# EAGLE design gateway_nano (EAGLE 9.3.0)
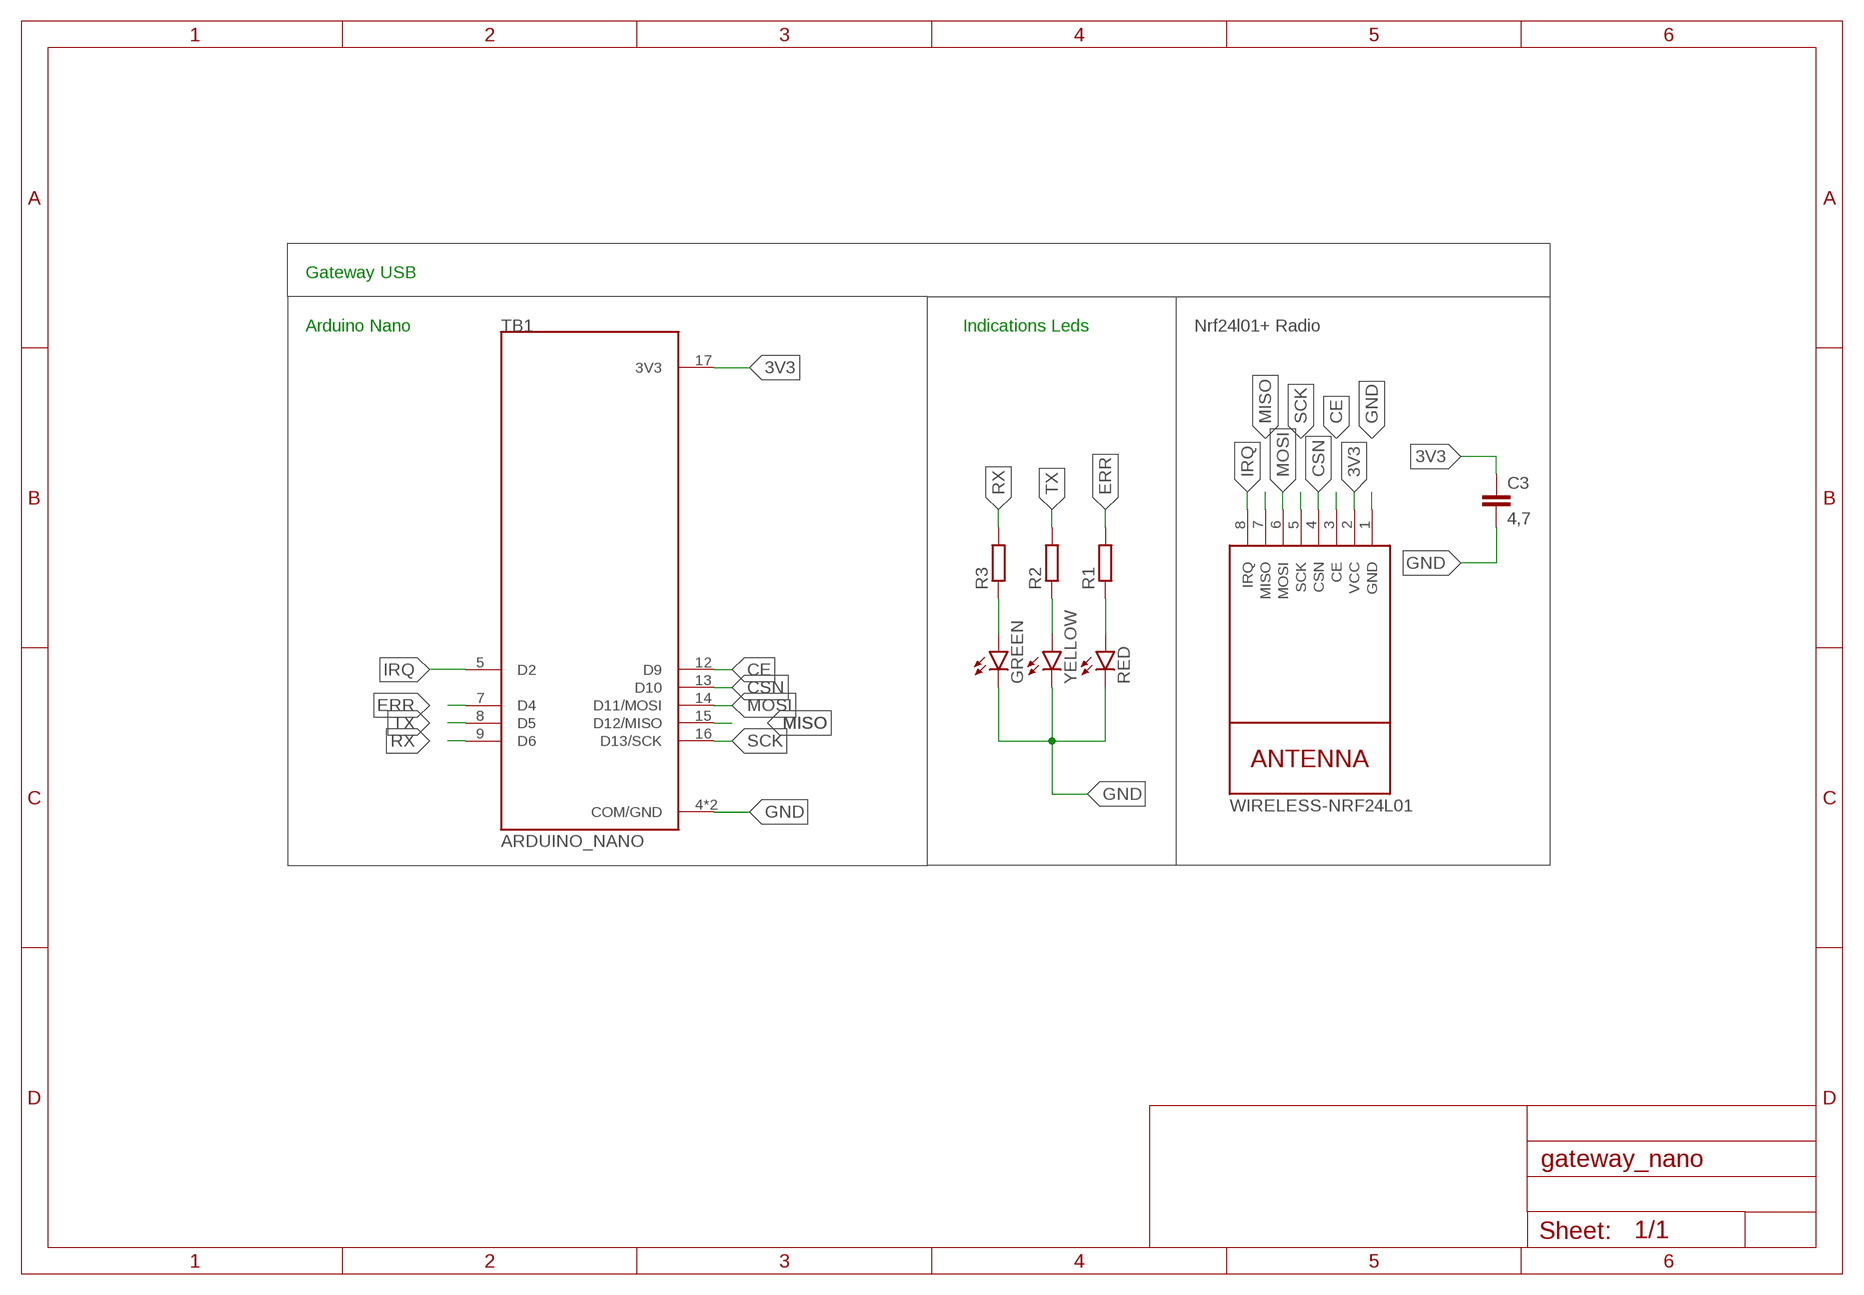
[diagram p0: schematic, sheet 1]

## Parts
C3  4,7  C2.5/2  [C2.5-2]
GREEN  LED5MM  [LED5MM]
NRF24L01+  WIRELESS-NRF24L01  [WIRELESS-NRF24L01]
R1  R-EU_R0805  [R0805]
R2  R-EU_R0805  [R0805]
R3  R-EU_R0805  [R0805]
RED  LED5MM  [LED5MM]
TB1  ARDUINO_NANO  [SHIELD_ARDUINO_NANO]
YELLOW  LED5MM  [LED5MM]

## Nets
3V3: C3.1 NRF24L01+.2(VCC) TB1.17(3V3)
CE: NRF24L01+.3(CE) TB1.12(D9)
CSN: NRF24L01+.4(CSN) TB1.13(D10)
ERR: R1.2 TB1.7(D4)
GND: C3.2 GREEN.K(C) NRF24L01+.1(GND) RED.K(C) TB1.4(COM/GND) TB1.29(COM/GND) YELLOW.K(C)
IRQ: NRF24L01+.8(IRQ) TB1.5(D2)
MISO: NRF24L01+.7(MISO) TB1.15(D12/MISO)
MOSI: NRF24L01+.6(MOSI) TB1.14(D11/MOSI)
N$1: R1.1 RED.A
N$2: R2.1 YELLOW.A
N$3: GREEN.A R3.1
RX: R3.2 TB1.9(D6)
SCK: NRF24L01+.5(SCK) TB1.16(D13/SCK)
TX: R2.2 TB1.8(D5)

## Notes on the sheet
- Gateway USB
- Arduino Nano | Indications Leds | Nrf24l01+ Radio

## Library data of the parts
C3 = capacitor-wima:C: CAPACITOR naming: grid - package width
GREEN RED YELLOW = Minha_Lib:LED: LED OSRAM: - CHIPLED LG R971, LG N971, LY N971, LG Q971, LY Q971, LO R971, LY R971 LH N974, LH R974 LS Q976, LO Q976, LY Q976 LO Q996 - Hyper CHIPLED LW Q18S LB Q993, LB Q99A, LB R99A - SideLED LS A670, LO A670, LY A670, LG A670, LP A670 LB A673, LV A673, LT A673, LW A673 LH A674 LY A675 LS A676, LA A676, LO A676, LY A676, LW A676 LS A679, LY A679, LG A679 - Hyper Micro SIDELED® LS Y876, LA Y876, LO Y876, LY Y876 LT Y87S - SmartLED LW L88C, LW L88S LB L89C, LB L89S, LG L890 LS L89K, LO L89K, LY L89K LS L896, LA L896, LO L896, LY L896 - TOPLED LS T670, LO T670, LY T670, LG T670, LP T670 LSG T670, LSP T670, LSY T670, LOP T670, LYG T670 LG T671, LOG T671, LSG T671 LB T673, LV T673, LT T673, LW T673 LH T674 LS T676, LA T676, LO T676, LY T676, LB T676, LH T676, LSB T676, LW T676 LB T67C, LV T67C, LT T67C, LS T67K, LO T67K, LY T67K, LW E67C LS E67B, LA E67B, LO E67B, LY E67B, LB E67C, LV E67C, LT E67C LW T67C LS T679, LY T679, LG T679 LS T770, LO T770, LY T770, LG T770, LP T770 LB T773, LV T773, LT T773, LW T773 LH T774 LS E675, LA E675, LY E675, LS T675 LS T776, LA T776, LO T776, LY T776, LB T776 LHGB T686 LT T68C, LB T68C - Hyper Mini TOPLED® LB M676 - Mini TOPLED Santana® LG M470 LS M47K, LO M47K, LY M47K Source: http://www.osram.convergy.de LUXEON: - LUMILED® LXK2-PW12-R00, LXK2-PW12-S00, LXK2-PW14-U00, LXK2-PW14-V00 LXK2-PM12-R00, LXK2-PM12-S00, LXK2-PM14-U00 LXK2-PE12-Q00, LXK2-PE12-R00, LXK2-PE12-S00, LXK2-PE14-T00, LXK2-PE14-U00 LXK2-PB12-K00, LXK2-PB12-L00, LXK2-PB12-M00, LXK2-PB14-N00, LXK2-PB14-P00, LXK2-PB14-Q00 LXK2-PR12-L00, LXK2-PR12-M00, LXK2-PR14-Q00, LXK2-PR14-R00 LXK2-PD12-Q00, LXK2-PD12-R00, LXK2-PD12-S00 LXK2-PH12-R00, LXK2-PH12-S00 LXK2-PL12-P00, LXK2-PL12-Q00, LXK2-PL12-R00 Source: www.luxeon.com KINGBRIGHT: KA-3528ASYC Source: www.kingbright.com
NRF24L01+ = diy-modules:WIRELESS-NRF24L01: 2.4 GHz Wireless Module based on NRF24L01 chip
R1-R3 = rcl:R-EU_: RESISTOR, European symbol; SPICEPREFIX: R
TB1 = ARDUINO_NANO:ARDUINO_NANO: Arduino Nano, Through Hole; AVAILABILITY: Unavailable; DESCRIPTION: ATmega328 Arduino Nano AVR® ATmega AVR MCU 8-Bit Embedded Evaluation Board; MF: Arduino; MP: ARDUINO NANO; PACKAGE: None; PRICE: None

## Board
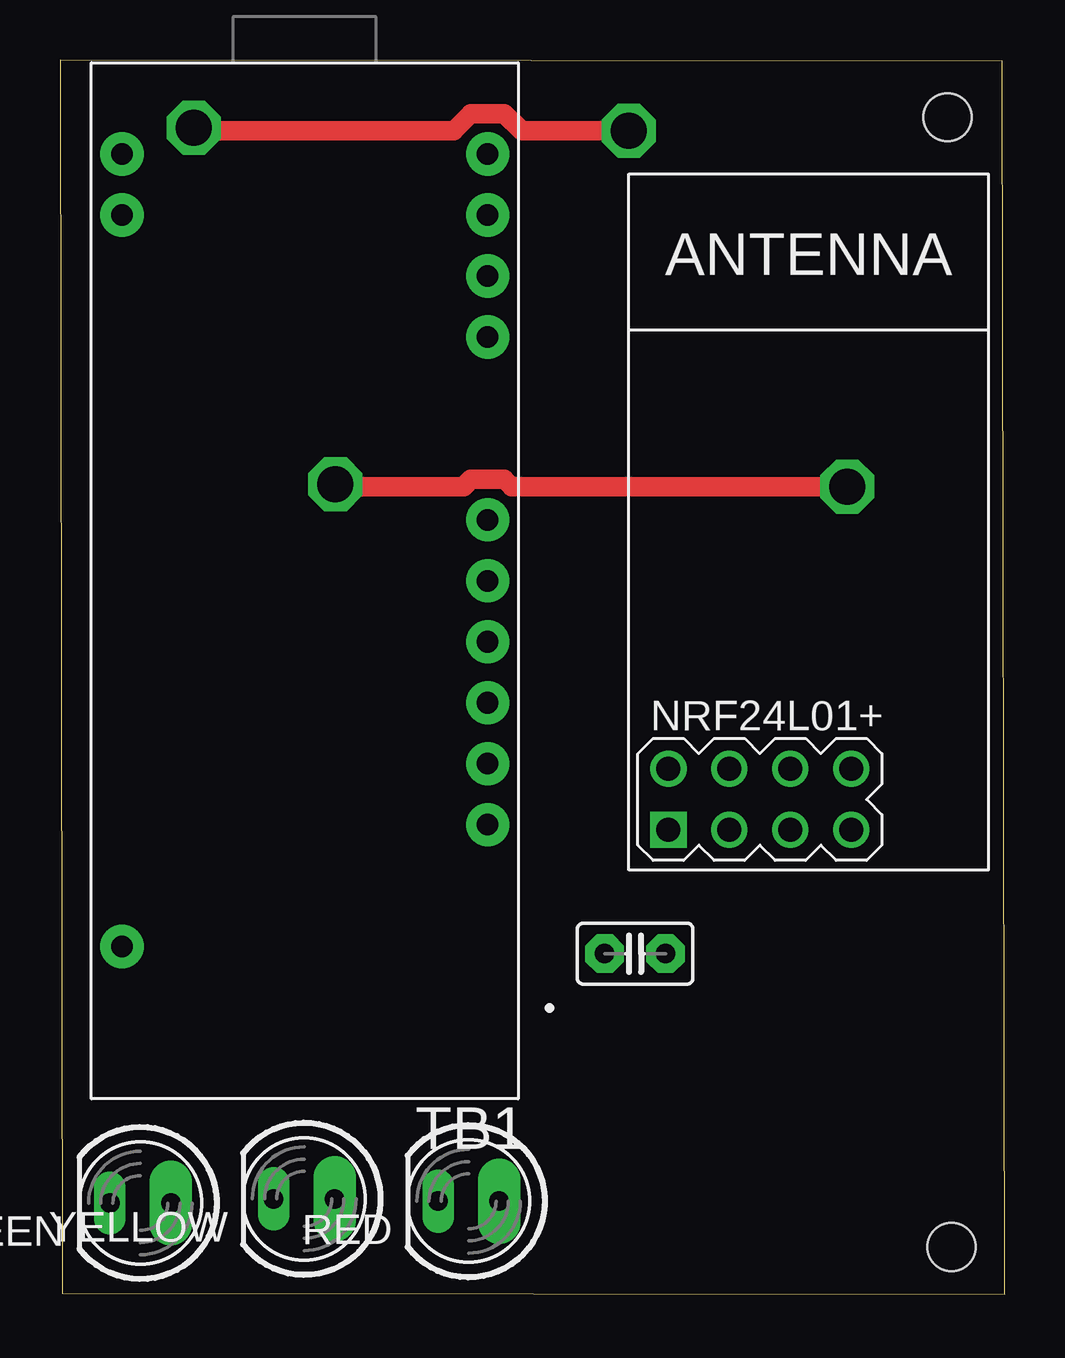
[diagram p1: board, top side]
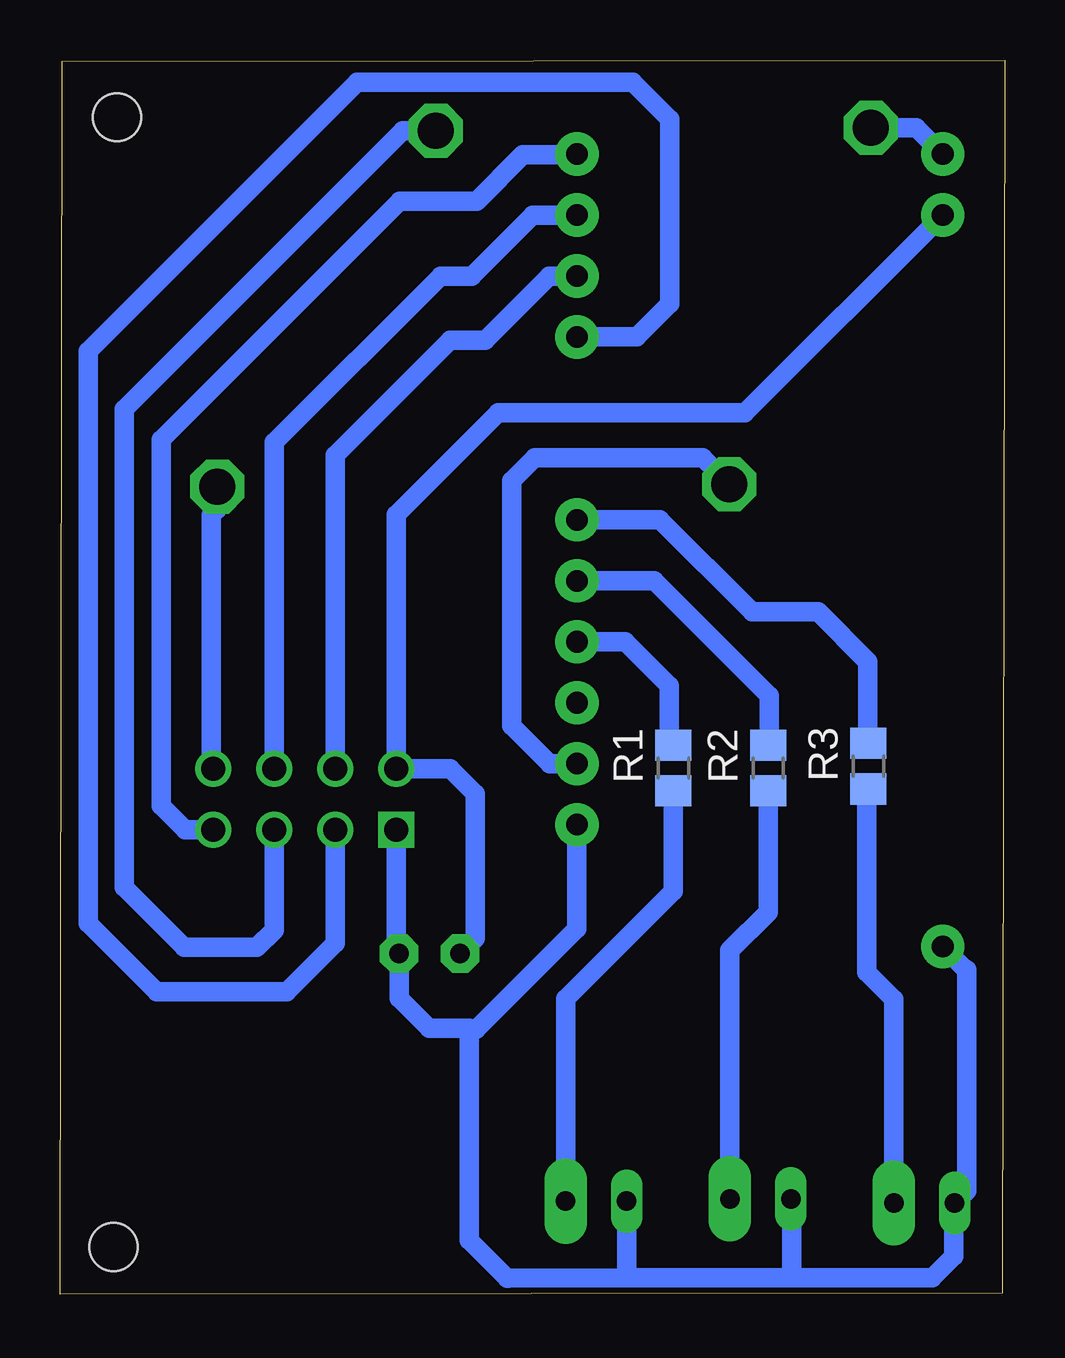
[diagram p2: board, bottom side, seen from below]

Size 39.36 x 51.43 mm. Coordinates in mm from the lower left corner, seen from the top.
Outline: 0.1,0.05 39.36,0 39.26,51.38 0,51.43 0.1,0.05
Copper layers (1*16): Top 0.035mm / dielectric 1.5mm / Bottom 0.035mm
Design rules "dirt_cheap_dirty_boards.v1 *": minimum track width 15mil, minimum drill 12mil, track to track 15mil, track to pad 15mil, pad to pad 15mil, via to via 15mil, smd to smd 0mil, copper to edge 10mil, drill to drill 10mil, minimum pad ring 10mil, minimum via ring 6mil, stop-mask expansion 2mil, vias tented up to drill 25mil, thermal gap 10mil
Holes 2 mm at 37.14,1.98 36.98,49.05

### Footprints (pad centres in the part's own frame; a part is rotated, then mirrored left to right if it is on the bottom)
C2.5-2 = drill 0.813 pad 1.6 octagon: 1 -1.27,0; 2 1.27,0
LED5MM = drill 0.813 pad 1.778 long: A -1.27,0 | drill 0.813 pad 1.016 long: K 1.27,0
WIRELESS-NRF24L01 = drill 1 square: 1 -12.7,6.35 | drill 1: 2 -10.16,6.35; 3 -12.7,3.81; 4 -10.16,3.81; 5 -12.7,1.27; 6 -10.16,1.27; 7 -12.7,-1.27; 8 -10.16,-1.27
R0805 = smd 1.3 x 1.5: 1 -0.95,0; 2 0.95,0
SHIELD_ARDUINO_NANO = drill 0.9 pad 1.8: 4 -7.62,10.16; 5 -7.62,7.62; 6 -7.62,5.08; 7 -7.62,2.54; 8 -7.62,0; 9 -7.62,-2.54; 12 -7.62,-10.16; 13 -7.62,-12.7; 14 -7.62,-15.24; 15 -7.62,-17.78; 16 7.62,-17.78; 17 7.62,-15.24; 29 7.62,15.24

### Placement (x,y rotation side)
C3  23.96,14.2 0 top
GREEN  3.35,3.81 180 top
NRF24L01+  31.7,32.06 90 top
R1  13.8,21.94 90 bottom
R2  9.85,21.94 90 bottom
R3  5.67,22.01 90 bottom
RED  17.03,3.88 180 top
TB1  10.2,29.74 180 top
YELLOW  10.18,3.99 180 top

### Tracks (layer width: path | path; a pad name or v marks a point on that pad's centre or on a via)
3V3
  Bottom 0.813: TB1.17 10.82,36.73 21.1,36.73 25.35,32.48 NRF24L01+.2 23.09,21.9 22.05,20.86 22.05,14.84 C3.1
CE
  Bottom 0.381: 17.62,40.13 TB1.12
  Bottom 0.813: TB1.12 17.8,39.91 15.33,39.91 13.95,41.28 13.95,48.96 15.5,50.51 26.98,50.51 38.17,39.31 38.17,15.46 35.32,12.61 29.91,12.61 27.89,14.63 NRF24L01+.3
CSN
  Bottom 0.813: NRF24L01+.4 27.89,34.97 23.1,39.76 21.65,39.76 18.98,42.43 TB1.13
ERR
  Bottom 0.381: 13.98,22.94 R1.2
  Bottom 0.813: TB1.7 15.81,27.2 13.98,25.36 13.98,22.94
GND
  Bottom 0.381: 15.62,3.88 RED.K | 9.12,3.88 YELLOW.K
  Bottom 0.813: C3.2 25.23,12.33 23.98,11.08 22.3,11.08 22.3,2.26 20.72,0.68 20.68,0.68 15.78,0.69 | 15.78,0.69 8.88,0.7 | 8.88,0.7 3.01,0.7 2.12,1.58 2.12,3.76 GREEN.K 1.57,4.31 1.57,13.54 1.62,13.54 TB1.29 | YELLOW.K 8.88,3.96 8.88,0.7 | RED.K 15.76,0.71 15.78,0.69 | TB1.4 17.82,15.25 22.01,11.06 22.3,11.06 | 25.4,14.17 25.35,14.12 NRF24L01+.1
IRQ  (via drill 1.5)
  Top 0.813: v32.8,33.66 18.82,33.66 18.52,33.96 17.12,33.96 16.82,33.66 11.65,33.66 11.55,33.76 v11.48,33.76
  Bottom 0.813: v32.8,33.66 32.8,32.71 33.05,32.46 33.05,21.98 NRF24L01+.8 | v11.48,33.76 12.58,34.86 19.57,34.86 20.53,33.91 20.53,23.69 18.96,22.12 TB1.5
MISO
  Bottom 0.381: 17.88,47.38 TB1.15
  Bottom 0.813: TB1.15 17.85,47.48 20.07,47.48 22,45.56 25.2,45.56 35.15,35.61 35.15,20.36 34.15,19.36 NRF24L01+.7
MOSI
  Bottom 0.813: NRF24L01+.6 30.43,35.5 23.5,42.43 22.2,42.43 19.66,44.98 TB1.14
N$1
  Bottom 0.381: 13.98,20.94 R1.1 | 18.12,3.88 RED.A
  Bottom 0.813: RED.A 18.3,12.31 13.8,16.81 R1.1
N$2
  Bottom 0.381: 10.3,20.54 R2.1
  Bottom 0.813: YELLOW.A 11.45,14.34 9.85,15.94 R2.1
N$3
  Bottom 0.381: 5.62,20.89 R3.1
  Bottom 0.813: GREEN.A 4.62,12.3 5.75,13.44 5.75,20.76 5.62,20.89
RX
  Bottom 0.813: TB1.9 14.37,32.27 10.53,28.44 7.77,28.44 5.7,26.36 5.7,22.99 R3.2
SCK  (via drill 1.5)
  Top 0.813: v23.7,48.48 19.24,48.48 18.52,49.2 17.12,49.2 16.4,48.48 5.6,48.48 5.58,48.51 v5.58,48.61
  Bottom 0.813: v5.58,48.61 3.67,48.61 TB1.16 | NRF24L01+.5 30.43,15.19 31.16,14.46 34.17,14.46 36.67,16.96 36.67,36.88 25.07,48.48 v23.7,48.48
TX
  Bottom 0.381: 10.05,23.04 R2.2
  Bottom 0.813: TB1.8 14.6,29.74 9.8,24.94 9.8,23.29 10.05,23.04